# EAGLE design hexpad (EAGLE 4.11)
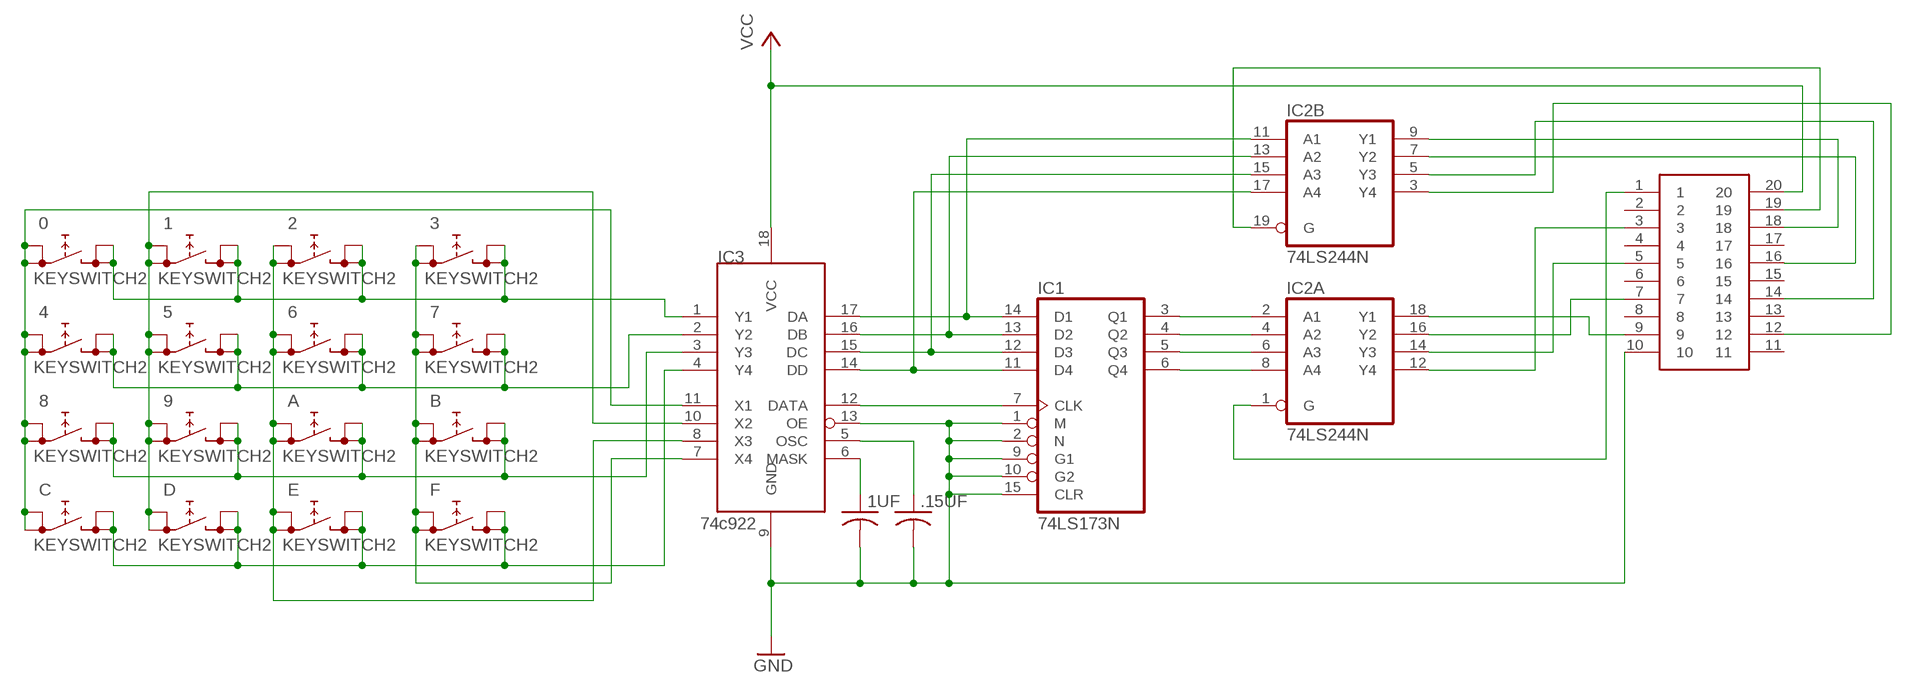
[diagram p0: schematic, sheet 1]

## Parts
0  KEYSWITCH2  [KEY2]
1  KEYSWITCH2  [KEY2]
1UF  C-US050-035X075  [C050-035X075]
2  KEYSWITCH2  [KEY2]
3  KEYSWITCH2  [KEY2]
4  KEYSWITCH2  [KEY2]
5  KEYSWITCH2  [KEY2]
6  KEYSWITCH2  [KEY2]
7  KEYSWITCH2  [KEY2]
8  KEYSWITCH2  [KEY2]
9  KEYSWITCH2  [KEY2]
74C922  74C922  [DIL18]
.15UF  C-US050-035X075  [C050-035X075]
A  KEYSWITCH2  [KEY2]
B  KEYSWITCH2  [KEY2]
C  KEYSWITCH2  [KEY2]
D  KEYSWITCH2  [KEY2]
E  KEYSWITCH2  [KEY2]
F  KEYSWITCH2  [KEY2]
IC1  74LS173N  [DIL16]
IC2  74LS244N  [DIL20]
U$2  DIP20CONNECTOR  [DIL20]

## Nets
D0: 74C922.17(DA) IC1.14(D1) IC2.11(B:A1)
D1: 74C922.16(DB) IC1.13(D2) IC2.13(B:A2)
D2: 74C922.15(DC) IC1.12(D3) IC2.15(B:A3)
D3: 74C922.14(DD) IC1.11(D4) IC2.17(B:A4)
D4: IC1.3(Q1) IC2.2(A:A1)
D5: IC1.4(Q2) IC2.4(A:A2)
D6: IC1.5(Q3) IC2.6(A:A3)
D7: IC1.6(Q4) IC2.8(A:A4)
GND: 1UF.2 74C922.9(GND) 74C922.13(OE) .15UF.2 IC1.1(M) IC1.2(N) IC1.9(G1) IC1.10(G2) IC1.15(CLR) U$2.10
N$1: 0.A0 0.A1 4.A0 4.A1 8.A0 8.A1 74C922.11(X1) C.A0 C.A1
N$2: 1.A0 1.A1 5.A0 5.A1 9.A0 9.A1 74C922.10(X2) D.A0 D.A1
N$3: 2.A0 2.A1 6.A0 6.A1 74C922.8(X3) A.A0 A.A1 E.A0 E.A1
N$4: 3.A0 3.A1 7.A0 7.A1 74C922.7(X4) B.A0 B.A1 F.A0 F.A1
N$5: 0.B0 0.B1 1.B0 1.B1 2.B0 2.B1 3.B0 3.B1 74C922.1(Y1)
N$6: 4.B0 4.B1 5.B0 5.B1 6.B0 6.B1 7.B0 7.B1 74C922.2(Y2)
N$7: 8.B0 8.B1 9.B0 9.B1 74C922.3(Y3) A.B0 A.B1 B.B0 B.B1
N$8: 74C922.4(Y4) C.B0 C.B1 D.B0 D.B1 E.B0 E.B1 F.B0 F.B1
N$9: IC2.1(A:G) U$2.1
N$10: IC2.9(B:Y1) U$2.18
N$11: IC2.7(B:Y2) U$2.16
N$12: IC2.19(B:G) U$2.19
N$13: IC2.5(B:Y3) U$2.14
N$14: IC2.3(B:Y4) U$2.12
N$15: IC2.18(A:Y1) U$2.9
N$16: IC2.16(A:Y2) U$2.7
N$17: 74C922.12(DATA) IC1.7(CLK)
N$18: IC2.14(A:Y3) U$2.5
N$19: IC2.12(A:Y4) U$2.3
N$31: 1UF.1 74C922.6(MASK)
N$32: 74C922.5(OSC) .15UF.1
VCC: 74C922.18(VCC) U$2.20
Unconnected: U$2.2 U$2.4 U$2.6 U$2.8 U$2.11 U$2.13 U$2.15 U$2.17

## Notes on the sheet
- IC3
- 74c922

## Power pins joined to a net without a drawn wire
GND: IC1.8(GND) IC2.10(P:GND)
VCC: IC1.16(VCC) IC2.20(P:VCC)

## Library data of the parts
0 1-9 A B C D E F = cdp:KEYSWITCH2
1UF .15UF = rcl:C-US: CAPACITOR, American symbol
74C922 = cdp:74C922
IC1 = 74xx-us:74*173: 4-bit D type REGISTER, 3-state
IC2 = 74xx-us:74*244: Octal BUFFER and LINE DRIVER, 3-state
U$2 = cdp:DIP20CONNECTOR

## Board
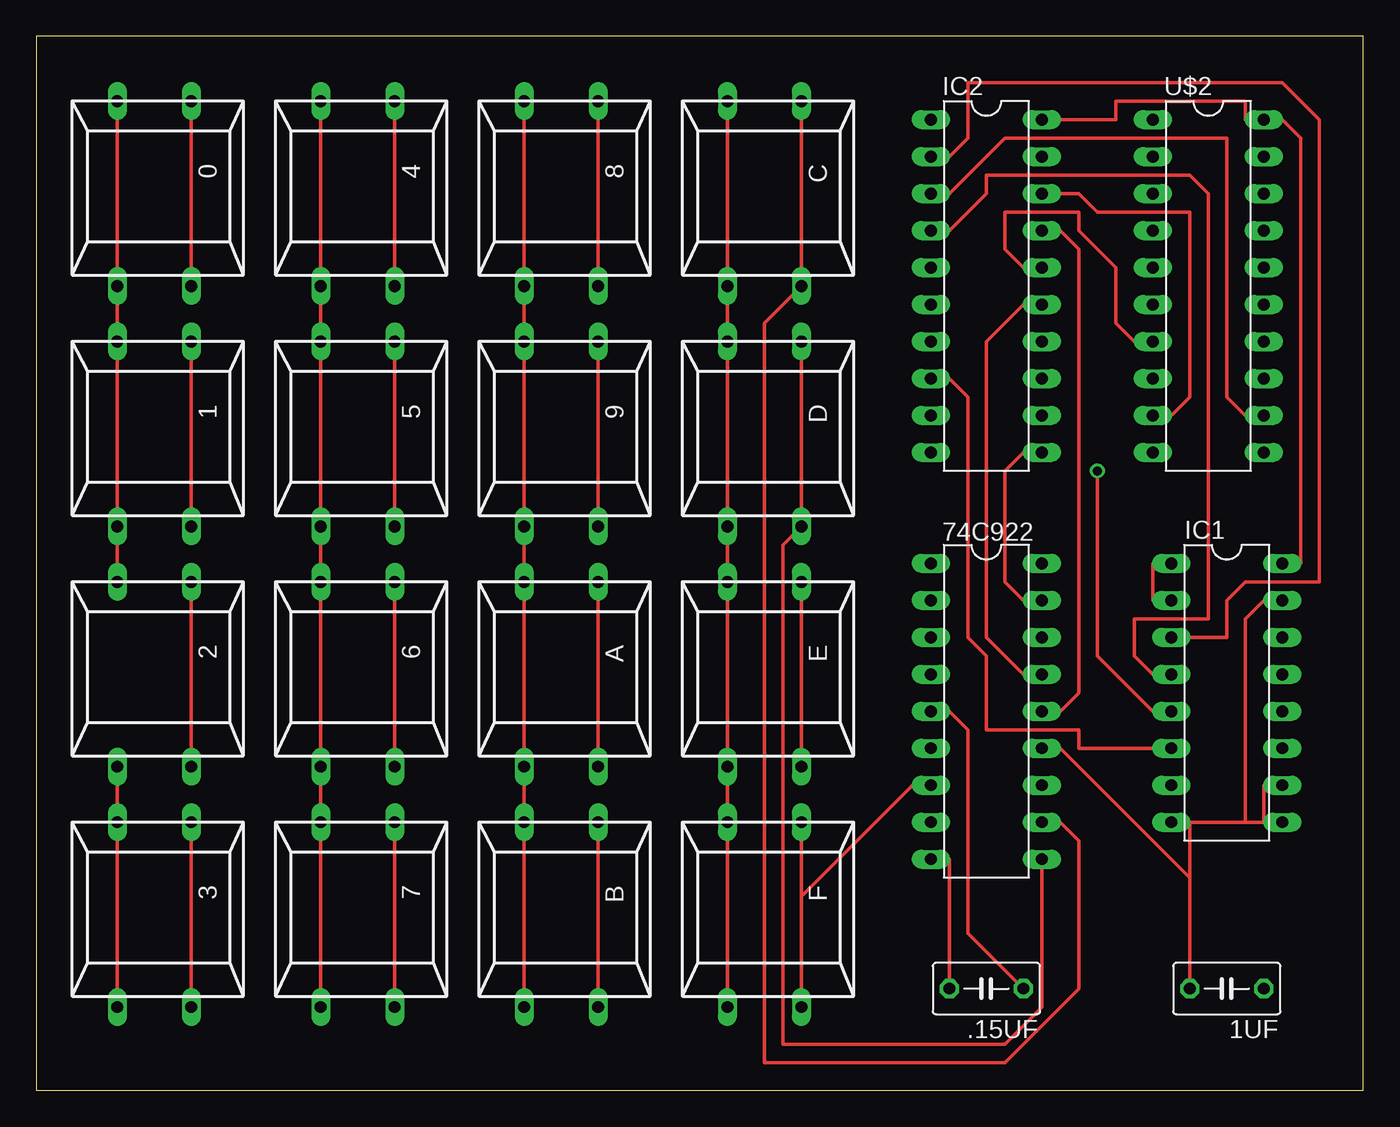
[diagram p1: board, top side]
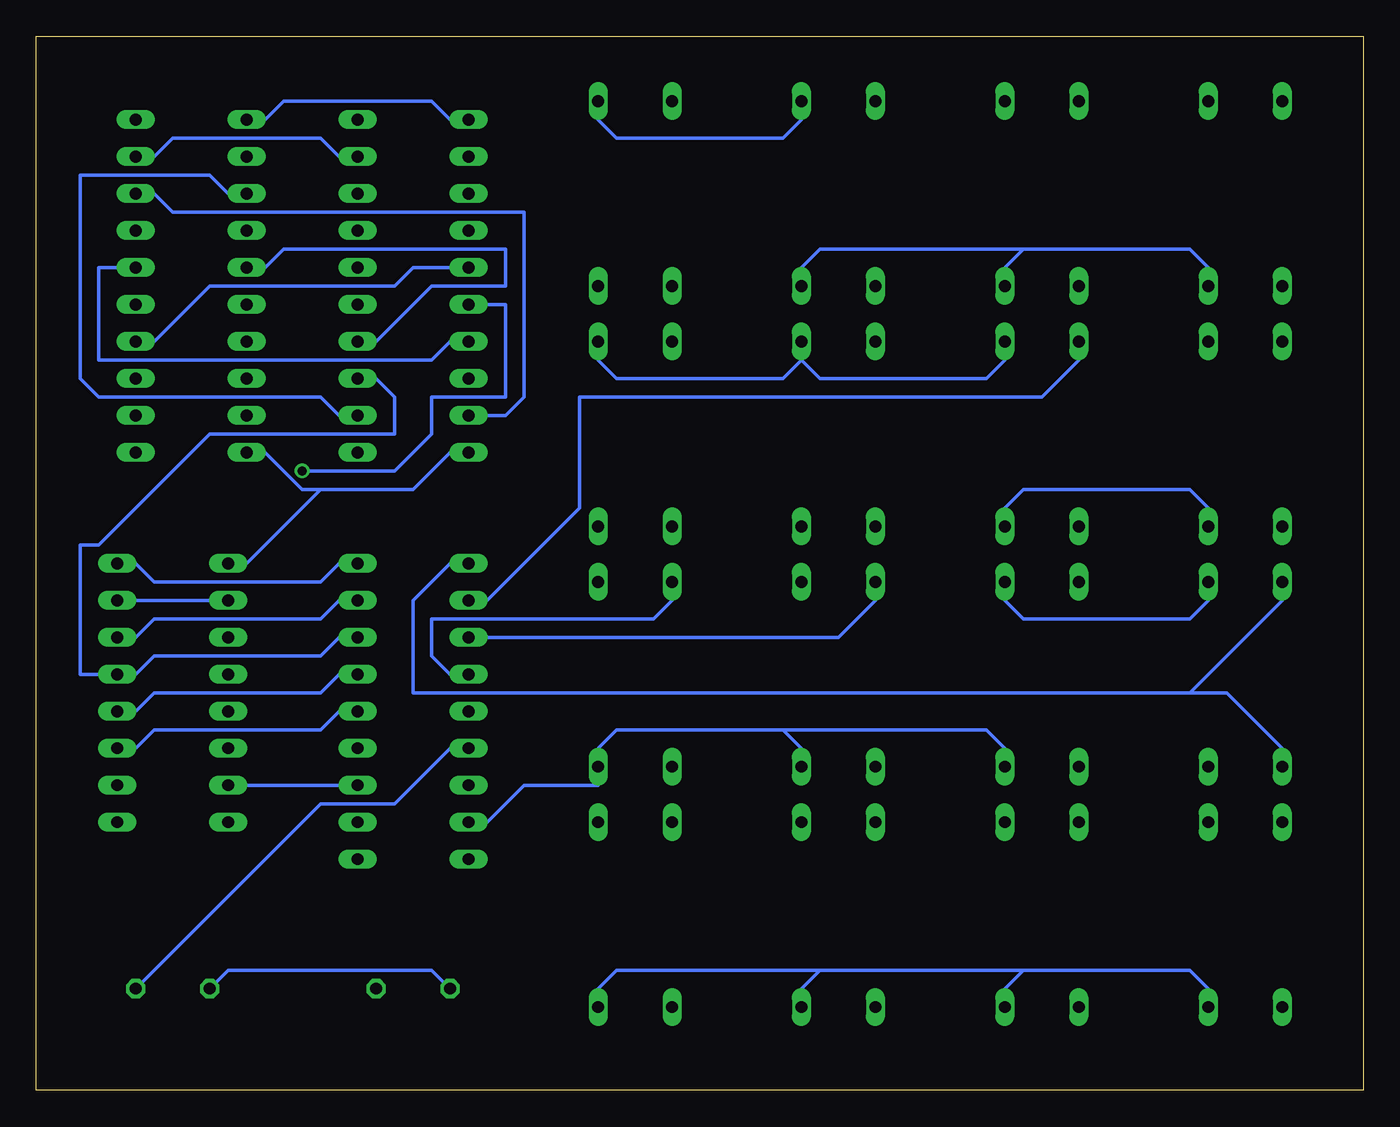
[diagram p2: board, bottom side, seen from below]

Size 91.11 x 72.38 mm. Coordinates in mm from the lower left corner, seen from the top.
Outline: 0,0 91.11,0 91.11,72.38 0,72.38 0,0
Copper layers (1*16): Top 0.035mm / dielectric 1.5mm / Bottom 0.035mm
Design rules "default": minimum track width 10mil, minimum drill 24mil, track to track 8mil, track to pad 8mil, pad to pad 8mil, via to via 8mil, smd to smd 8mil, copper to edge 40mil, drill to drill 8mil, minimum pad ring 10mil, minimum via ring 8mil, stop-mask expansion 4mil, vias tented up to drill 0mil, thermal gap 10mil

### Footprints (pad centres in the part's own frame; a part is rotated, then mirrored left to right if it is on the bottom)
KEY2 = drill 0.813 long: A0 -6.35,2.54; A1 6.35,2.54; B0 -6.35,-2.54; B1 6.35,-2.54
C050-035X075 = drill 0.813 octagon: 1 -2.54,0; 2 2.54,0
DIL18 = drill 0.813 long: 1 -10.16,-3.81; 2 -7.62,-3.81; 3 -5.08,-3.81; 4 -2.54,-3.81; 5 0,-3.81; 6 2.54,-3.81; 7 5.08,-3.81; 8 7.62,-3.81; 9 10.16,-3.81; 10 10.16,3.81; 11 7.62,3.81; 12 5.08,3.81; 13 2.54,3.81; 14 0,3.81; 15 -2.54,3.81; 16 -5.08,3.81; 17 -7.62,3.81; 18 -10.16,3.81
DIL16 = drill 0.813 long: 1 -8.89,-3.81; 2 -6.35,-3.81; 3 -3.81,-3.81; 4 -1.27,-3.81; 5 1.27,-3.81; 6 3.81,-3.81; 7 6.35,-3.81; 8 8.89,-3.81; 9 8.89,3.81; 10 6.35,3.81; 11 3.81,3.81; 12 1.27,3.81; 13 -1.27,3.81; 14 -3.81,3.81; 15 -6.35,3.81; 16 -8.89,3.81
DIL20 = drill 0.813 long: 1 -11.43,-3.81; 2 -8.89,-3.81; 3 -6.35,-3.81; 4 -3.81,-3.81; 5 -1.27,-3.81; 6 1.27,-3.81; 7 3.81,-3.81; 8 6.35,-3.81; 9 8.89,-3.81; 10 11.43,-3.81; 11 11.43,3.81; 12 8.89,3.81; 13 6.35,3.81; 14 3.81,3.81; 15 1.27,3.81; 16 -1.27,3.81; 17 -3.81,3.81; 18 -6.35,3.81; 19 -8.89,3.81; 20 -11.43,3.81

### Placement (x,y rotation side)
0  8.09,61.59 270 top
1  8.09,45.08 270 top
1UF  81.75,6.98 180 top
2  8.09,28.57 270 top
3  8.09,12.06 270 top
4  22.06,61.59 270 top
5  22.06,45.08 270 top
6  22.06,28.57 270 top
7  22.06,12.06 270 top
8  36.03,61.59 270 top
9  36.03,45.08 270 top
74C922  65.24,26.03 270 top
.15UF  65.24,6.98 180 top
A  36.03,28.57 270 top
B  36.03,12.06 270 top
C  50,61.59 270 top
D  50,45.08 270 top
E  50,28.57 270 top
F  50,12.06 270 top
IC1  81.75,27.3 270 top
IC2  65.24,55.24 270 top
U$2  80.48,55.24 270 top

### Tracks (layer width: path | path; a pad name or v marks a point on that pad's centre or on a via)
D0
  Top 0.254: 74C922.17 67.78,33.65 66.51,34.92 66.51,42.54 67.78,43.81 IC2.11
  Bottom 0.254: IC1.14 84.29,31.11 83.02,32.38 71.59,32.38 70.32,33.65 74C922.17
D1
  Bottom 0.254: 74C922.16 70.32,31.11 71.59,29.84 83.02,29.84 84.29,28.57 IC1.13 88.1,28.57 88.1,37.46 86.83,37.46 79.21,45.08 66.51,45.08 66.51,47.62 67.78,48.89 IC2.13
D2
  Top 0.254: IC2.15 67.78,53.97 65.24,51.43 65.24,31.11 67.78,28.57 74C922.15
  Bottom 0.254: 74C922.15 70.32,28.57 71.59,27.3 83.02,27.3 84.29,26.03 IC1.12
D3
  Top 0.254: IC2.17 70.32,59.05 71.59,57.78 71.59,27.3 70.32,26.03 74C922.14
  Bottom 0.254: 74C922.14 70.32,26.03 71.59,24.76 83.02,24.76 84.29,23.49 IC1.11
D4
  Top 0.254: IC1.3 81.75,31.11 81.75,33.65 83.02,34.92 88.1,34.92 88.1,66.67 85.56,69.21 63.97,69.21 63.97,65.4 62.7,64.13 IC2.2
D5
  Top 0.254: IC1.4 76.67,28.57 75.4,29.84 75.4,32.38 80.48,32.38 80.48,61.59 79.21,62.86 65.24,62.86 65.24,61.59 62.7,59.05 IC2.4
D6  (via drill 0.61)
  Top 0.254: v72.86,42.54 72.86,29.84 76.67,26.03 IC1.5
  Bottom 0.254: v72.86,42.54 66.51,42.54 63.97,45.08 63.97,47.62 58.89,47.62 58.89,53.97 IC2.6
D7
  Top 0.254: IC1.6 71.59,23.49 71.59,24.76 65.24,24.76 65.24,29.84 63.97,31.11 63.97,47.62 62.7,48.89 IC2.8
GND
  Top 0.254: IC1.2 76.67,33.65 76.67,36.19 IC1.1 | .15UF.2 62.7,15.87 74C922.9 | 84.29,18.41 84.29,20.95 IC1.10 | 79.21,14.6 79.21,18.41 | 1UF.2 79.21,14.6 | 79.21,14.6 70.32,23.49 74C922.13 | 79.21,18.41 83.02,18.41 | 83.02,18.41 84.29,18.41 | 84.29,18.41 IC1.9 | 79.21,18.41 IC1.8 | 83.02,18.41 83.02,32.38 84.29,33.65 IC1.15
  Bottom 0.254: IC1.15 IC1.2 | 71.59,41.27 72.86,41.27 75.4,43.81 U$2.10 | 71.59,41.27 65.24,41.27 62.7,43.81 IC2.10 | 71.59,41.27 76.67,36.19 IC1.1 | .15UF.2 63.97,8.25 77.94,8.25 1UF.2
N$1
  Top 0.254: 8.A0 8.A1 | 0.A1 0.A0 | 4.A1 4.A0 | C.A0 C.A1 50,52.7 50,1.9 66.51,1.9 71.59,6.98 71.59,17.14 70.32,18.41 74C922.11
  Bottom 0.254: 23.33,57.78 11.9,57.78 10.63,56.51 0.A1 | 23.33,57.78 24.6,56.51 4.A1 | 23.33,57.78 37.3,57.78 38.57,56.51 8.A1 | 8.A0 38.57,66.67 39.84,65.4 51.27,65.4 52.54,66.67 C.A0
N$2
  Top 0.254: 9.A0 9.A1 | 1.A1 1.A0 | 5.A1 5.A0 | D.A0 D.A1 51.27,37.46 51.27,3.17 66.51,3.17 69.05,5.71 74C922.10
  Bottom 0.254: 1.A1 10.63,40 11.9,41.27 23.33,41.27 24.6,40 5.A1 | 38.57,50.16 37.3,48.89 25.87,48.89 24.6,50.16 5.A0 | 38.57,50.16 39.84,48.89 51.27,48.89 52.54,50.16 D.A0 | 38.57,50.16 9.A0
N$3
  Top 0.254: 2.A1 2.A0 | 6.A0 6.A1 | A.A1 A.A0 | E.A1 E.A0
  Bottom 0.254: 2.A0 10.63,33.65 11.9,32.38 23.33,32.38 24.6,33.65 6.A0 | 74C922.8 60.16,18.41 57.62,20.95 52.54,20.95 E.A1 52.54,23.49 51.27,24.76 39.84,24.76 | 39.84,24.76 38.57,23.49 A.A1 | 39.84,24.76 25.87,24.76 24.6,23.49 6.A1
N$4
  Top 0.254: F.A1 52.54,13.33 | 52.54,13.33 F.A0 | 52.54,13.33 60.16,20.95 74C922.7 | B.A1 B.A0 | 3.A1 3.A0 | 7.A1 7.A0
  Bottom 0.254: 23.33,8.25 11.9,8.25 10.63,6.98 3.A1 | 23.33,8.25 24.6,6.98 7.A1 | 37.3,8.25 38.57,6.98 B.A1 | 23.33,8.25 37.3,8.25 | 37.3,8.25 51.27,8.25 52.54,6.98 F.A1
N$5
  Top 0.254: 0.B0 0.B1 1.B0 1.B1 2.B0 | 3.B1 3.B0 2.B1
  Bottom 0.254: 11.9,27.3 9.36,27.3 5.55,23.49 2.B1 | 11.9,27.3 65.24,27.3 65.24,33.65 62.7,36.19 74C922.1 | 11.9,27.3 5.55,33.65 2.B0
N$6
  Top 0.254: 7.B1 7.B0 6.B1 6.B0 5.B1 5.B0 4.B1 4.B0
  Bottom 0.254: 74C922.2 60.16,33.65 53.81,40 53.81,47.62 22.06,47.62 19.52,50.16 5.B0
N$7
  Top 0.254: 8.B0 8.B1 9.B0 9.B1 A.B0 A.B1 B.B0 B.B1
  Bottom 0.254: 74C922.3 36.03,31.11 33.49,33.65 A.B0
N$8
  Top 0.254: C.B0 C.B1 D.B0 D.B1 E.B0 E.B1 F.B0 F.B1
  Bottom 0.254: 74C922.4 62.7,28.57 63.97,29.84 63.97,32.38 48.73,32.38 47.46,33.65 E.B0
N$9
  Bottom 0.254: IC2.1 62.7,66.67 63.97,67.94 74.13,67.94 75.4,66.67 U$2.1
N$10
  Bottom 0.254: IC2.9 58.89,46.35 57.62,47.62 57.62,60.32 81.75,60.32 83.02,61.59 U$2.18
N$11
  Bottom 0.254: IC2.7 62.7,51.43 63.97,50.16 86.83,50.16 86.83,56.51 U$2.16
N$12
  Bottom 0.254: IC2.19 70.32,64.13 71.59,65.4 81.75,65.4 83.02,64.13 U$2.19
N$13
  Bottom 0.254: IC2.5 65.24,56.51 66.51,55.24 79.21,55.24 83.02,51.43 U$2.14
N$14
  Top 0.254: IC2.3 62.7,61.59 66.51,65.4 81.75,65.4 81.75,47.62 83.02,46.35 U$2.12
N$15
  Top 0.254: U$2.9 77.94,46.35 79.21,47.62 79.21,60.32 72.86,60.32 71.59,61.59 IC2.18
N$16
  Top 0.254: IC2.16 67.78,56.51 66.51,57.78 66.51,60.32 71.59,60.32 71.59,59.05 74.13,56.51 74.13,52.7 75.4,51.43 U$2.7
N$17
  Bottom 0.254: 74C922.12 IC1.7
N$18
  Bottom 0.254: IC2.14 67.78,51.43 63.97,55.24 58.89,55.24 58.89,57.78 74.13,57.78 75.4,56.51 U$2.5
N$19
  Bottom 0.254: IC2.12 70.32,46.35 71.59,47.62 86.83,47.62 88.1,48.89 88.1,62.86 79.21,62.86 77.94,61.59 U$2.3
N$31
  Bottom 0.254: 1UF.1 71.59,19.68 66.51,19.68 62.7,23.49 74C922.6
N$32
  Top 0.254: .15UF.1 63.97,10.79 63.97,24.76 62.7,26.03 74C922.5
VCC
  Top 0.254: IC2.20 74.13,66.67 74.13,67.94 83.02,67.94 83.02,66.67 U$2.20 85.56,66.67 86.83,65.4 86.83,36.19 IC1.16
  Bottom 0.254: 74C922.18 70.32,36.19 71.59,34.92 83.02,34.92 84.29,36.19 IC1.16